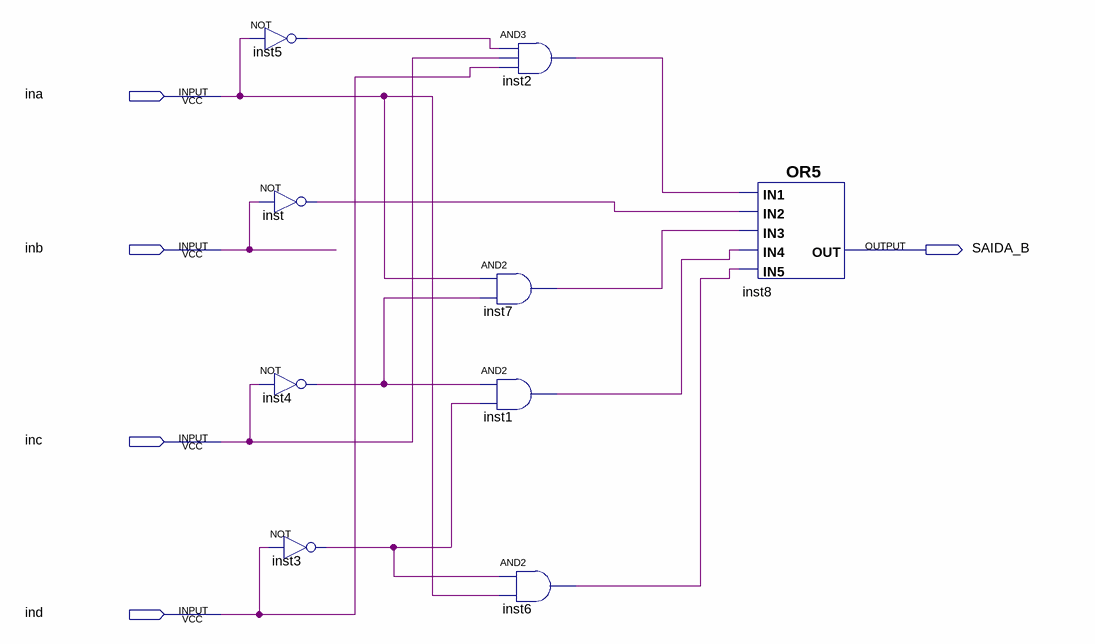
[diagram p0: schematic sheet]
// Quartus schematic b.bdf as structural Verilog: 9 symbols, 5 pins
module b (
  input  ina,
  input  inb,
  input  inc,
  input  ind,
  output SAIDA_B
);

  wire inst1_out, inst2_out, inst3_out, inst4_out, inst5_out, inst6_out, inst7_out, inst_out;

  not inst5 (inst5_out, ina);
  not inst (inst_out, inb);
  not inst4 (inst4_out, inc);
  not inst3 (inst3_out, ind);
  and inst2 (inst2_out, inst5_out, inc, ind);
  and inst7 (inst7_out, ina, inst4_out);
  and inst1 (inst1_out, inst4_out, inst3_out);
  and inst6 (inst6_out, inst3_out, ina);
  or inst8 (SAIDA_B, inst2_out, inst_out, inst7_out, inst1_out, inst6_out);
endmodule
